# EAGLE design Mem128_rev_A (EAGLE 9.6.2)
PC Engine Joypad Breakout Version 1.0
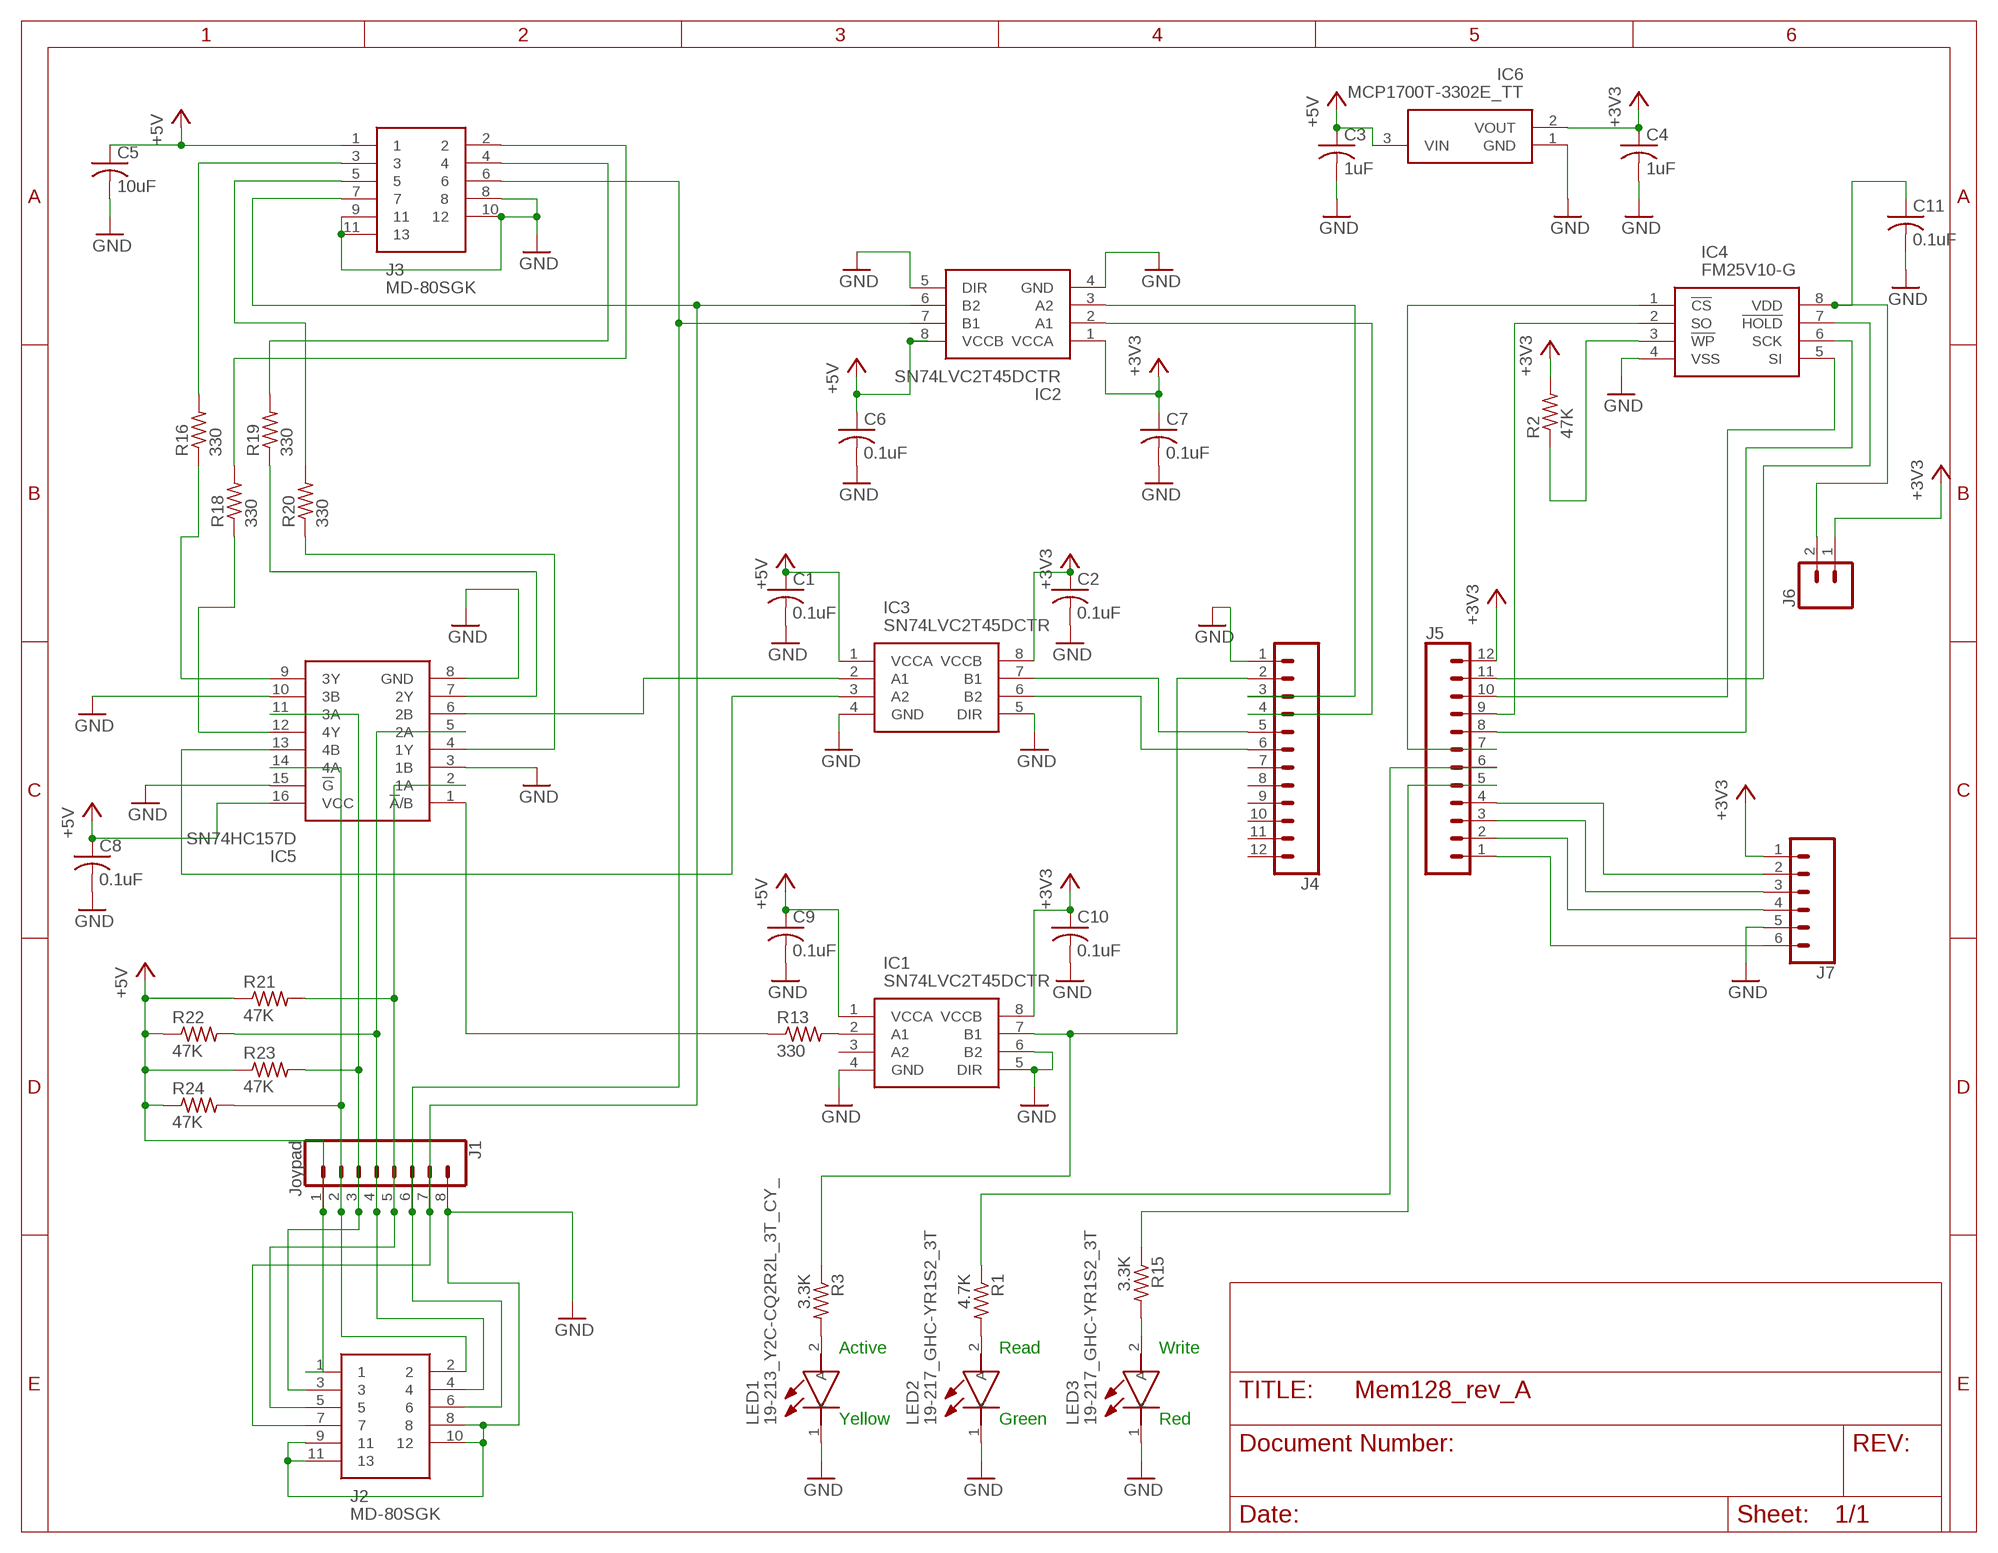
[diagram p0: schematic, sheet 1]

## Parts
C1  0.1uF  C-USC0603  [C0603]
C2  0.1uF  C-USC0603  [C0603]
C3  1uF  C-USC0603  [C0603]
C4  1uF  C-USC0603  [C0603]
C5  10uF  C-USC0805  [C0805]
C6  0.1uF  C-USC0603  [C0603]
C7  0.1uF  C-USC0603  [C0603]
C8  0.1uF  C-USC0603  [C0603]
C9  0.1uF  C-USC0603  [C0603]
C10  0.1uF  C-USC0603  [C0603]
C11  0.1uF  C-USC0603  [C0603]
IC1  SN74LVC2T45DCTR  [SOP65P400X130-8N]
IC2  SN74LVC2T45DCTR  [SOP65P400X130-8N]
IC3  SN74LVC2T45DCTR  [SOP65P400X130-8N]
IC4  FM25V10-G  [SOIC127P602X173-8N]
IC5  SN74HC157D  [SOIC127P600X175-16N]
IC6  MCP1700T-3302E_TT  [SOT95P237X112-3N]
J1  Joypad  CONN_08"  [1X08]
J2  MD-80SGK  [MD80SGK]
J3  MD-80SGK  [MD80SGK]
J4  CONN_12  [1X12]
J5  CONN_12  [1X12]
J6  CONN_02  [1X02]
J7  CONN_06NO_SILK_FEMALE_PTH  [1X06_NO_SILK]
LED1  19-213_Y2C-CQ2R2L_3T_CY_  [LEDC1608X60N]
LED2  19-217_GHC-YR1S2_3T  [LEDC1608X50N]
LED3  19-217_GHC-YR1S2_3T  [LEDC1608X50N]
R1  4.7K  R-US_R0603  [R0603]
R2  47K  R-US_R0603  [R0603]
R3  3.3K  R-US_R0603  [R0603]
R13  330  R-US_R0603  [R0603]
R15  3.3K  R-US_R0603  [R0603]
R16  330  R-US_R0603  [R0603]
R18  330  R-US_R0603  [R0603]
R19  330  R-US_R0603  [R0603]
R20  330  R-US_R0603  [R0603]
R21  47K  R-US_R0603  [R0603]
R22  47K  R-US_R0603  [R0603]
R23  47K  R-US_R0603  [R0603]
R24  47K  R-US_R0603  [R0603]

## Nets
+3V3 [power]: C2.1 C4.1 C7.1 C10.1 IC1.8(VCCB) IC2.1(VCCA) IC3.8(VCCB) IC6.2(VOUT) J5.12 J6.1 J7.1 R2.2
+5V [power]: C1.1 C3.1 C5.1 C6.1 C8.1 C9.1 IC1.1(VCCA) IC2.8(VCCB) IC3.1(VCCA) IC5.16(VCC) IC6.3(VIN) J1.1 J2.1 J3.1 R21.1 R22.1 R23.1 R24.1
CLR [signal]: IC2.6(B2) J1.7 J2.7 J3.7
D6 [signal]: J5.5 R15.1
D10 [signal]: J5.6 R1.1
D11 [signal]: IC1.7(B1) J4.2 R3.1
GND: C1.2 C2.2 C3.2 C4.2 C5.2 C6.2 C7.2 C8.2 C9.2 C10.2 C11.2 IC1.4(GND) IC1.5(DIR) IC1.6(B2) IC2.4(GND) IC2.5(DIR) IC3.4(GND) IC3.5(DIR) IC4.4(VSS) IC5.3(1B) IC5.8(GND) IC5.10(3B) IC5.15(!G) IC6.1(GND) J1.8 J2.8 J2.9 J2.10 J2.11 J3.8 J3.9 J3.10 J3.11 J4.1 J7.5 LED1.1(K) LED2.1(K) LED3.1(K)
N$1: LED2.2(A) R1.2
N$2 [signal]: IC5.11(3A) J1.3 J2.3 R23.2
N$3 [signal]: IC5.14(4A) J1.2 J2.2 R24.2
N$5: LED1.2(A) R3.2
N$6: IC4.7(!HOLD) J5.11
N$7: IC4.6(SCK) J5.8
N$8: J3.5 R20.2
N$10: J3.4 R19.2
N$11: J3.3 R16.2
N$12 [power]: C11.1 IC4.8(VDD) J6.2
N$14: IC5.1(!A!/B) R13.1
N$15: IC1.2(A1) R13.2
N$16: IC5.5(2A) J1.4 J2.4 R22.2
N$17: IC5.9(3Y) R16.1
N$18: IC5.2(1A) J1.5 J2.5 R21.2
N$19: IC3.2(A1) IC5.6(2B)
N$20: IC5.12(4Y) R18.1
N$22: IC5.4(1Y) R20.1
N$23: J3.2 R18.2
N$24: IC5.7(2Y) R19.1
N$25: IC4.3(!WP) R2.1
N$26: IC4.1(!CS) J5.7
N$28: IC4.5(SI) J5.10
N$30: IC3.3(A2) IC5.13(4B)
N$31: IC4.2(SO) J5.9
N$32: IC2.3(A2) J4.3
N$33: IC3.7(B1) J4.5
N$34: IC3.6(B2) J4.6
N$35: J5.1 J7.6
N$36: LED3.2(A) R15.2
N$37: J5.2 J7.4
N$38: J5.3 J7.3
N$39: J5.4 J7.2
RX: IC2.2(A1) J4.4
SEL [signal]: IC2.7(B1) J1.6 J2.6 J3.6
Unconnected: IC1.3(A2) J4.7 J4.8 J4.9 J4.10 J4.11 J4.12

## Notes on the sheet
- Active | Read | Write
- Yellow | Green | Red

## Library data of the parts
C1-C11 = resistor:C-US: CAPACITOR, American symbol
IC1-IC3 = SamacSys_Parts:SN74LVC2T45DCTR: 2-Bit Bus Transceiver, Translation SSOP8 SN74LVC2T45DCTR, Voltage Level Translator, Bus Transceiver LVC, 3-State 1.65 Source: Datasheet <http://www.ti.com/lit/ds/symlink/sn74lvc2t45.pdf>; DESCRIPTION: 2-Bit Bus Transceiver, Translation SSOP8 SN74LVC2T45DCTR, Voltage Level Translator, Bus Transceiver LVC, 3-State 1.65; HEIGHT: 1.3mm; MANUFACTURER_NAME: Texas Instruments; MANUFACTURER_PART_NUMBER: SN74LVC2T45DCTR; MOUSER_PART_NUMBER: 595-SN74LVC2T45DCTR; MOUSER_PRICE-STOCK: https://www.mouser.com/Search/Refine.aspx?Keyword=595-SN74LVC2T45DCTR; RS_PART_NUMBER: 9213022; RS_PRICE-STOCK: http://uk.rs-online.com/web/p/products/9213022
IC4 = PC-Engine:FM25V10-G: F-RAM,128KB,SPI,40MHz,3V,SOIC8 FM25V10-G Serial-SPI FRAM Memory, 1Mbit, 2 3.6 V 8-Pin SOIC Source: Datasheet <http://www.cypress.com/file/41691/download>; ARROW_PART_NUMBER: FM25V10-G; ARROW_PRICE-STOCK: https://www.arrow.com/en/products/fm25v10-g/cypress-semiconductor; DESCRIPTION: F-RAM,128KB,SPI,40MHz,3V,SOIC8 FM25V10-G Serial-SPI FRAM Memory, 1Mbit, 2 3.6 V 8-Pin SOIC; HEIGHT: 1.727mm; MANUFACTURER_NAME: Cypress Semiconductor; MANUFACTURER_PART_NUMBER: FM25V10-G; MOUSER_PART_NUMBER: 877-FM25V10-G; MOUSER_PRICE-STOCK: https://www.mouser.co.uk/ProductDetail/Cypress-Semiconductor/FM25V10-G?qs=pA5MXup5wxFqKGjf8NeQmw%3D%3D
IC5 = PC-Engine:SN74HC157D: Quadruple 2-Line To 1-Line Data Selectors/Multiplexers Source: Datasheet <http://www.ti.com/lit/ds/symlink/sn74hc157.pdf>; ARROW_PART_NUMBER: SN74HC157D; ARROW_PRICE-STOCK: https://www.arrow.com/en/products/sn74hc157d/texas-instruments; DESCRIPTION: Quadruple 2-Line To 1-Line Data Selectors/Multiplexers; HEIGHT: 1.75mm; MANUFACTURER_NAME: Texas Instruments; MANUFACTURER_PART_NUMBER: SN74HC157D; MOUSER_PART_NUMBER: 595-SN74HC157D; MOUSER_PRICE-STOCK: https://www.mouser.co.uk/ProductDetail/Texas-Instruments/SN74HC157D?qs=UGVLDq%2F29uhSeVegTExyng%3D%3D
IC6 = PC-Engine:MCP1700T-3302E_TT: LDO voltage regulator 250mA Isupply 1uA Source: Datasheet <http://docs-emea.rs-online.com/webdocs/0dd1/0900766b80dd189b.pdf>; ARROW_PART_NUMBER: MCP1700T-3302E/TT; ARROW_PRICE-STOCK: https://www.arrow.com/en/products/mcp1700t-3302ett/microchip-technology; DESCRIPTION: LDO voltage regulator 250mA Isupply 1uA; HEIGHT: 1.12mm; MANUFACTURER_NAME: Microchip; MANUFACTURER_PART_NUMBER: MCP1700T-3302E/TT; MOUSER_PART_NUMBER: 579-MCP1700T3302E/TT; MOUSER_PRICE-STOCK: https://www.mouser.co.uk/ProductDetail/Microchip-Technology/MCP1700T-3302E-TT?qs=fM4xO01eazPmCNDrdHEdaw%3D%3D
J1 = SparkFun-Connectors:CONN_08: Multi connection point. Often used as Generic Header-pin footprint for 0.1 inch spaced/style header connections On any of the 0.1 inch spaced packages, you can populate with these: Break Away Headers - Straight <https://www.sparkfun.com/products/116> (PRT-00116) Break Away Male Headers - Right Angle <https://www.sparkfun.com/products/553> (PRT-00553) Female Headers <https://www.sparkfun.com/products/115> (PRT-00115) Break Away Headers - Machine Pin <https://www.sparkfun.com/products/117> (PRT-00117) Break Away Female Headers - Swiss Machine Pin <https://www.sparkfun.com/products/743> (PRT-00743) Arduino Stackable Header - 8 Pin <https://www.sparkfun.com/products/9279> (PRT-09279) For SCREWTERMINALS and SPRING TERMINALS visit here: Screw Terimnals on SparkFun.com <https://www.sparkfun.com/search/results?term=Screw+Terminals> (5mm/3.5mm/2.54mm spacing) This device is also useful as a general connection point to wire up your design to another part of your project. Our various solder wires solder well into these plated through hole pads. Hook-Up Wire - Assortment (Stranded, 22 AWG) <https://www.sparkfun.com/products/11375> (PRT-11375) Hook-Up Wire - Assortment (Solid Core, 22 AWG) <https://www.sparkfun.com/products/11367> (PRT-11367) View the entire wire category on our website here <https://www.sparkfun.com/categories/141> Special notes: Molex polarized connector foot print use with SKU : PRT-08231 with associated crimp pins and housings. 1MM SMD Version SKU: PRT-10208 NOTES ON THE VARIANTS LOCK and LOCK_LONGPADS... This footprint was designed to help hold the alignment of a through-hole component (i.e. 6-pin header) while soldering it into place. You may notice that each hole has been shifted either up or down by 0.005 of an inch from it's more standard position (which is a perfectly straight line). This slight alteration caused the pins (the squares in the middle) to touch the edges of the holes. Because they are alternating, it causes a "brace" to hold the component in place. 0.005 has proven to be the perfect amount of "off-center" position when using our standard breakaway headers. Although looks a little odd when you look at the bare footprint, once you have a header in there, the alteration is very hard to notice. Also,if you push a header all the way into place, it is covered up entirely on the bottom side.; PROD_ID: CONN-08438
J2 J3 = SamacSys_Parts:MD-80SGK: Circular DIN Connectors mini-DIN, 8P jack, rt, through hole, full shield Source: Datasheet <https://www.cui.com/product/resource/md-sgk-series.pdf>; DESCRIPTION: Circular DIN Connectors mini-DIN, 8P jack, rt, through hole, full shield; HEIGHT: 13mm; MANUFACTURER_NAME: CUI; MANUFACTURER_PART_NUMBER: MD-80SGK; MOUSER_PART_NUMBER: 490-MD-80SGK; MOUSER_PRICE-STOCK: https://www.mouser.com/Search/Refine.aspx?Keyword=490-MD-80SGK
J4 J5 = SparkFun-Connectors:CONN_12: Multi connection point. Often used as Generic Header-pin footprint for 0.1 inch spaced/style header connections On any of the 0.1 inch spaced packages, you can populate with these: Break Away Headers - Straight <https://www.sparkfun.com/products/116> (PRT-00116) Break Away Male Headers - Right Angle <https://www.sparkfun.com/products/553> (PRT-00553) Female Headers <https://www.sparkfun.com/products/115> (PRT-00115) Break Away Headers - Machine Pin <https://www.sparkfun.com/products/117> (PRT-00117) Break Away Female Headers - Swiss Machine Pin <https://www.sparkfun.com/products/743> (PRT-00743) For SCREWTERMINALS and SPRING TERMINALS visit here: Screw Terimnals on SparkFun.com <https://www.sparkfun.com/search/results?term=Screw+Terminals> (5mm/3.5mm/2.54mm spacing) This device is also useful as a general connection point to wire up your design to another part of your project. Our various solder wires solder well into these plated through hole pads. Hook-Up Wire - Assortment (Stranded, 22 AWG) <https://www.sparkfun.com/products/11375> (PRT-11375) Hook-Up Wire - Assortment (Solid Core, 22 AWG) <https://www.sparkfun.com/products/11367> (PRT-11367) View the entire wire category on our website here <https://www.sparkfun.com/categories/141> Special notes: Molex polarized connector foot print use with SKU : PRT-08231 with associated crimp pins and housings. 1MM SMD Version SKU: PRT-10208 NOTES ON THE VARIANTS LOCK and LOCK_LONGPADS... This footprint was designed to help hold the alignment of a through-hole component (i.e. 6-pin header) while soldering it into place. You may notice that each hole has been shifted either up or down by 0.005 of an inch from it's more standard position (which is a perfectly straight line). This slight alteration caused the pins (the squares in the middle) to touch the edges of the holes. Because they are alternating, it causes a "brace" to hold the component in place. 0.005 has proven to be the perfect amount of "off-center" position when using our standard breakaway headers. Although looks a little odd when you look at the bare footprint, once you have a header in there, the alteration is very hard to notice. Also,if you push a header all the way into place, it is covered up entirely on the bottom side.
J6 = SparkFun-Connectors:CONN_02: Multi connection point. Often used as Generic Header-pin footprint for 0.1 inch spaced/style header connections On any of the 0.1 inch spaced packages, you can populate with these: Break Away Headers - Straight <https://www.sparkfun.com/products/116> (PRT-00116) Break Away Male Headers - Right Angle <https://www.sparkfun.com/products/553> (PRT-00553) Female Headers <https://www.sparkfun.com/products/115> (PRT-00115) Break Away Headers - Machine Pin <https://www.sparkfun.com/products/117> (PRT-00117) Break Away Female Headers - Swiss Machine Pin <https://www.sparkfun.com/products/743> (PRT-00743) For SCREWTERMINALS and SPRING TERMINALS visit here: Screw Terimnals on SparkFun.com <https://www.sparkfun.com/search/results?term=Screw+Terminals> (5mm/3.5mm/2.54mm spacing) This device is also useful as a general connection point to wire up your design to another part of your project. Our various solder wires solder well into these plated through hole pads. Hook-Up Wire - Assortment (Stranded, 22 AWG) <https://www.sparkfun.com/products/11375> (PRT-11375) Hook-Up Wire - Assortment (Solid Core, 22 AWG) <https://www.sparkfun.com/products/11367> (PRT-11367) View the entire wire category on our website here <https://www.sparkfun.com/categories/141> Special notes: Molex polarized connector foot print use with: PRT-08233 with associated crimp pins and housings. 2.54_SCREWTERM for use with PRT-10571. 3.5mm Screw Terminal footprints for PRT-08084 5mm Screw Terminal footprints for use with PRT-08432
J7 = SparkFun-Connectors:CONN_06: Multi connection point. Often used as Generic Header-pin footprint for 0.1 inch spaced/style header connections On any of the 0.1 inch spaced packages, you can populate with these: Break Away Headers - Straight <https://www.sparkfun.com/products/116> (PRT-00116) Break Away Male Headers - Right Angle <https://www.sparkfun.com/products/553> (PRT-00553) Female Headers <https://www.sparkfun.com/products/115> (PRT-00115) Break Away Headers - Machine Pin <https://www.sparkfun.com/products/117> (PRT-00117) Break Away Female Headers - Swiss Machine Pin <https://www.sparkfun.com/products/743> (PRT-00743) Arduino Stackable Header - 6 Pin <https://www.sparkfun.com/products/9280> (PRT-09280) For SCREWTERMINALS and SPRING TERMINALS visit here: Screw Terimnals on SparkFun.com <https://www.sparkfun.com/search/results?term=Screw+Terminals> (5mm/3.5mm/2.54mm spacing) This device is also useful as a general connection point to wire up your design to another part of your project. Our various solder wires solder well into these plated through hole pads. Hook-Up Wire - Assortment (Stranded, 22 AWG) <https://www.sparkfun.com/products/11375> (PRT-11375) Hook-Up Wire - Assortment (Solid Core, 22 AWG) <https://www.sparkfun.com/products/11367> (PRT-11367) View the entire wire category on our website here <https://www.sparkfun.com/categories/141>; PROD_ID: CONN-08437
LED1 = PC-Engine:19-213_Y2C-CQ2R2L_3T_CY_: 0603 Package Chip LED (0.6mm Height) Source: Datasheet <https://datasheet.lcsc.com/szlcsc/Everlight-Elec-19-213-Y2C-CQ2R2L-3T-CY_C72038.pdf>; ARROW_PART_NUMBER: 19-213/Y2C-CQ2R2L/3T(CY); DESCRIPTION: 0603 Package Chip LED (0.6mm Height); HEIGHT: 0.6mm; MANUFACTURER_NAME: Everlight Elec; MANUFACTURER_PART_NUMBER: 19-213/Y2C-CQ2R2L/3T(CY)
LED2 = PC-Engine:19-217_GHC-YR1S2_3T: Standard LEDs - SMD Source: Datasheet <https://www.arrow.com/en/products/19-217ghc-yr1s23t/everlight-electronics>; ARROW_PART_NUMBER: 19-217/GHC-YR1S2/3T; ARROW_PRICE-STOCK: https://www.arrow.com/en/products/19-217ghc-yr1s23t/everlight-electronics; DESCRIPTION: Standard LEDs - SMD; HEIGHT: 0.5mm; MANUFACTURER_NAME: Everlight; MANUFACTURER_PART_NUMBER: 19-217/GHC-YR1S2/3T; MOUSER_PART_NUMBER: 638-19217GHCYR1S23T; MOUSER_PRICE-STOCK: https://www.mouser.co.uk/ProductDetail/Everlight/19-217-GHC-YR1S2-3T?qs=8cKuZ6Ok2lZjmFTUzVFjDg%3D%3D
LED3 = PC-Engine:19-217_GHC-YR1S2_3T: Standard LEDs - SMD Source: Datasheet <https://www.arrow.com/en/products/19-217ghc-yr1s23t/everlight-electronics>; ARROW_PART_NUMBER: 19-217/GHC-YR1S2/3T; ARROW_PRICE-STOCK: https://www.arrow.com/en/products/19-217ghc-yr1s23t/everlight-electronics; DESCRIPTION: Standard LEDs - SMD; HEIGHT: 0.5mm; MANUFACTURER_NAME: Hubei Kento; MANUFACTURER_PART_NUMBER: KT-0603R; MOUSER_PART_NUMBER: 638-19217GHCYR1S23T; MOUSER_PRICE-STOCK: https://www.mouser.co.uk/ProductDetail/Everlight/19-217-GHC-YR1S2-3T?qs=8cKuZ6Ok2lZjmFTUzVFjDg%3D%3D
R1-R3 R13 R15 R16 R18-R24 = resistor:R-US_: RESISTOR, American symbol

## Net classes
0 default: width 0.152 mm, drill 0.356 mm, clearance 0.152 mm
1 power: width 0.305 mm, drill 0.356 mm, clearance 0.152 mm
2 signal: width 0.152 mm, drill 0.356 mm, clearance 0.152 mm

## Board
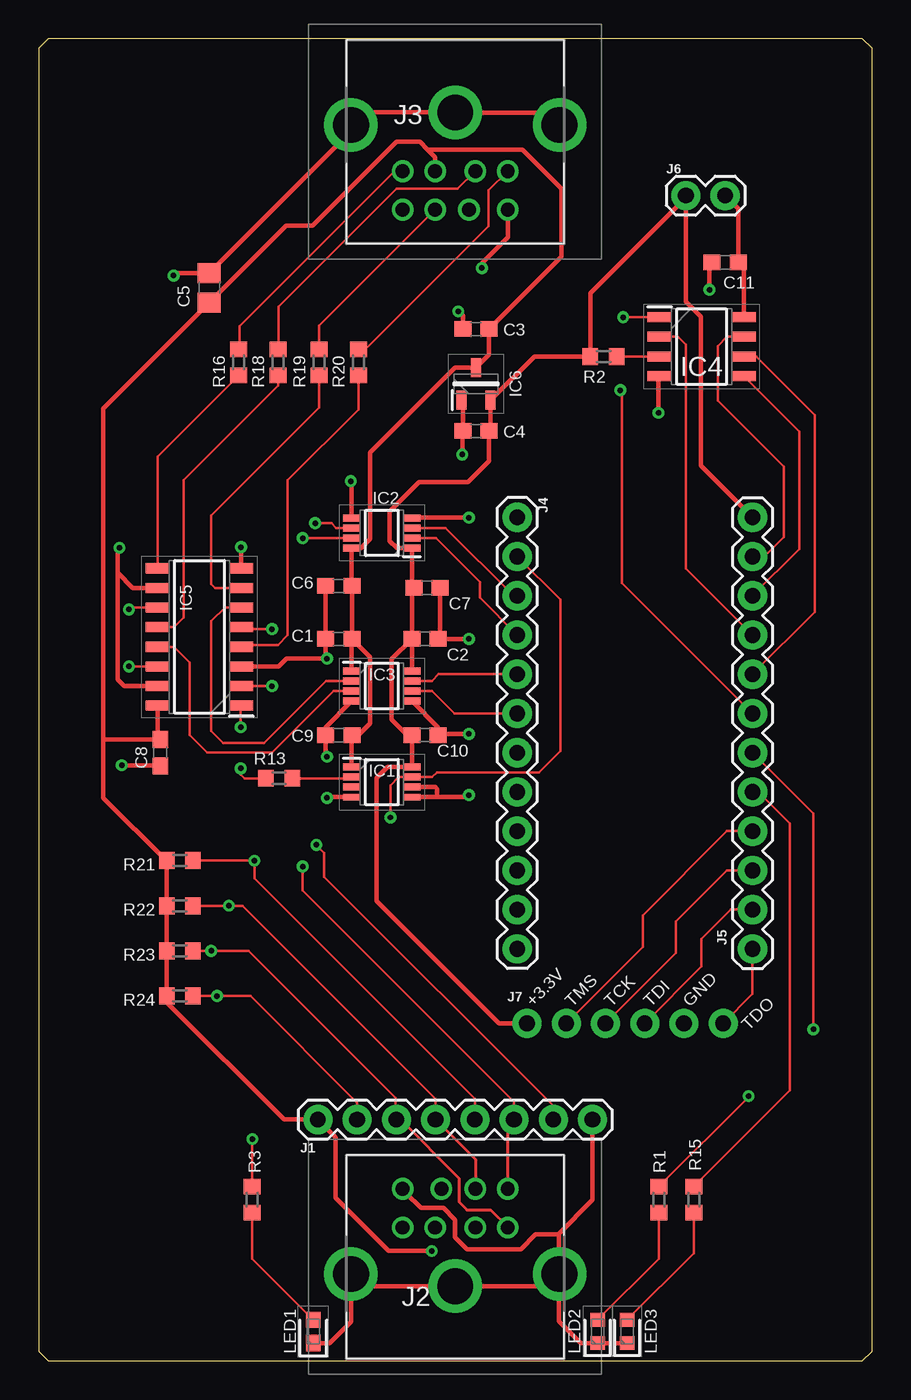
[diagram p1: board, top side]
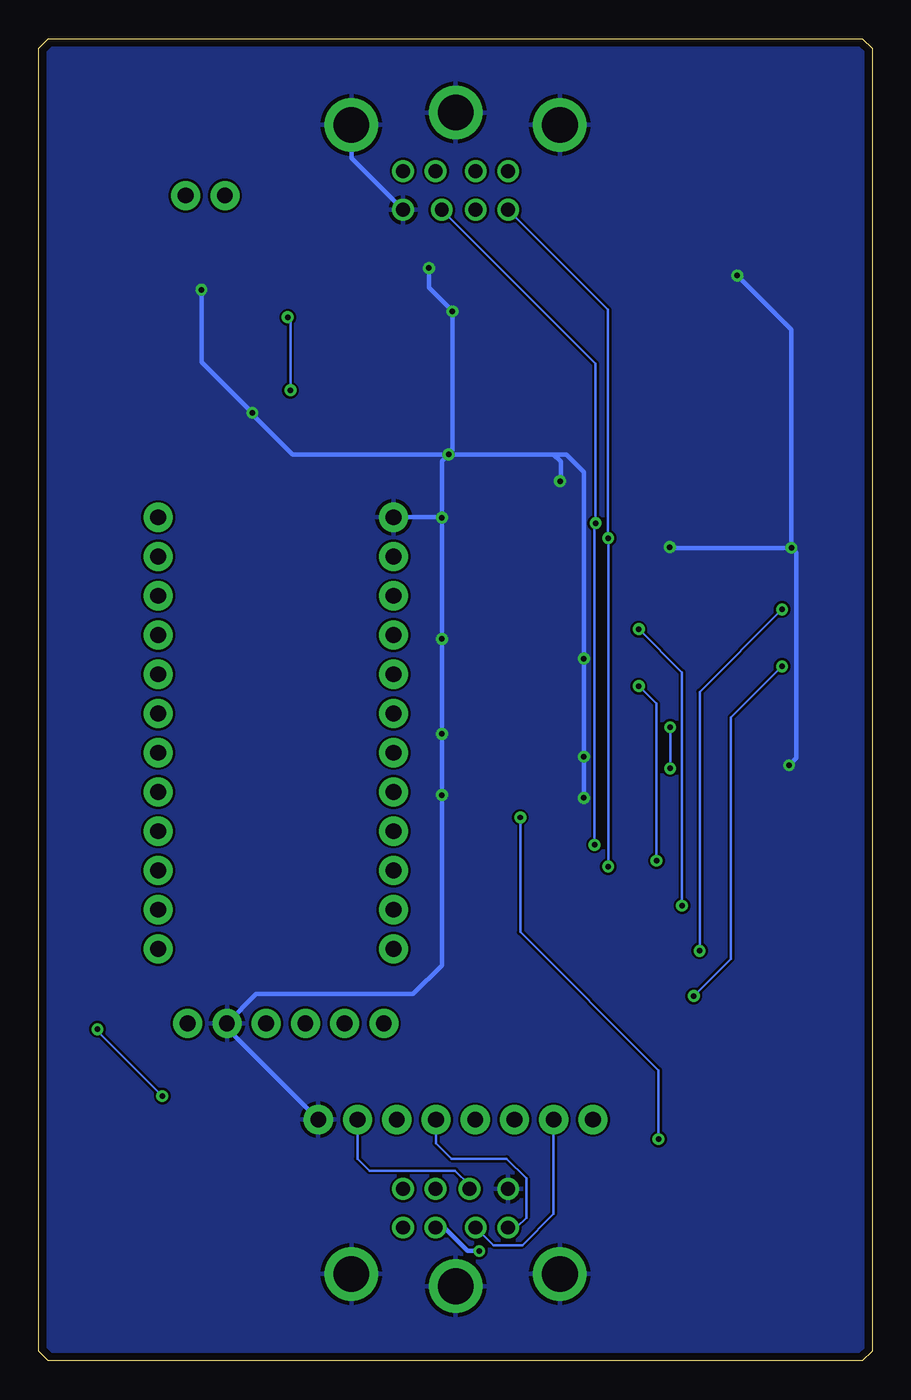
[diagram p2: board, bottom side, seen from below]

Size 53.98 x 85.6 mm. Coordinates in mm from the lower left corner, seen from the top.
Outline: 53.34,85.6 0.64,85.6 0,84.96 0,0.64 0.64,0 53.34,0 53.98,0.64 53.98,84.96 53.34,85.6
Copper layers (1*16): Top 0.035mm / dielectric 1.5mm / Bottom 0.035mm
Design rules "default *": minimum track width 6mil, minimum drill 0.35mm, track to track 6mil, track to pad 6mil, pad to pad 6mil, via to via 6mil, smd to smd 6mil, copper to edge 20mil, drill to drill 6mil, minimum pad ring 10mil, minimum via ring 8mil, stop-mask expansion 3mil, vias tented up to drill 0mil, thermal gap 10mil

### Footprints (pad centres in the part's own frame; a part is rotated, then mirrored left to right if it is on the bottom)
C0603 = smd 1.1 x 1: 1 -0.85,0; 2 0.85,0
C0805 = smd 1.3 x 1.5: 1 -0.95,0; 2 0.95,0
SOP65P400X130-8N = smd 1.1 x 0.45: 1 -1.95,0.975; 2 -1.95,0.325; 3 -1.95,-0.325; 4 -1.95,-0.975; 5 1.95,-0.975; 6 1.95,-0.325; 7 1.95,0.325; 8 1.95,0.975
SOIC127P602X173-8N = smd 1.551 x 0.65: 1 -2.725,1.905; 2 -2.725,0.635; 3 -2.725,-0.635; 4 -2.725,-1.905; 5 2.725,-1.905; 6 2.725,-0.635; 7 2.725,0.635; 8 2.725,1.905
SOIC127P600X175-16N = smd 1.525 x 0.65: 1 -2.712,4.445; 2 -2.712,3.175; 3 -2.712,1.905; 4 -2.712,0.635; 5 -2.712,-0.635; 6 -2.712,-1.905; 7 -2.712,-3.175; 8 -2.712,-4.445; 9 2.712,-4.445; 10 2.712,-3.175; 11 2.712,-1.905; 12 2.712,-0.635; 13 2.712,0.635; 14 2.712,1.905; 15 2.712,3.175; 16 2.712,4.445
SOT95P237X112-3N = smd 1.25 x 0.65: 1 -1.05,0.95; 2 -1.05,-0.95; 3 1.05,0
1X08 = drill 1.016 pad 1.88: 1 0,0; 2 2.54,0; 3 5.08,0; 4 7.62,0; 5 10.16,0; 6 12.7,0; 7 15.24,0; 8 17.78,0
MD80SGK = drill 0.9 pad 1.4: 1 -1.3,-1.9; 2 1.3,-1.9; 3 -3.4,-1.9; 4 -1.3,-4.4; 5 3.4,-1.9; 6 -3.4,-4.4; 7 0.9,-4.4; 8 3.4,-4.4 | drill 2.309 pad 3.463: 9 0,1.9; 10 -6.75,1.1; 11 6.75,1.1
1X12 = drill 1.016 pad 1.88: 1 0,0; 2 2.54,0; 3 5.08,0; 4 7.62,0; 5 10.16,0; 6 12.7,0; 7 15.24,0; 8 17.78,0; 9 20.32,0; 10 22.86,0; 11 25.4,0; 12 27.94,0
1X02 = drill 1.016 pad 1.88: 1 0,0; 2 2.54,0
1X06_NO_SILK = drill 1.016 pad 1.88: 1 0,0; 2 2.54,0; 3 5.08,0; 4 7.62,0; 5 10.16,0; 6 12.7,0
LEDC1608X60N = smd 1.05 x 0.95: 1 -0.75,0; 2 0.75,0
LEDC1608X50N = smd 0.9 x 0.95: 1 -0.75,0; 2 0.75,0
R0603 = smd 1 x 1.1: 1 -0.85,0; 2 0.85,0

### Placement (x,y rotation side)
C1  19.43,46.74 180 top
C2  25.02,46.74 0 top
C3  28.32,66.8 180 top
C4  28.32,60.2 180 top
C5  11.05,69.47 90 top
C6  19.43,50.16 180 top
C7  25.15,50.04 0 top
C8  7.87,39.37 270 top
C9  19.43,40.51 180 top
C10  25.02,40.51 0 top
C11  44.45,71.12 180 top
IC1  22.23,37.47 0 top
IC2  22.23,53.59 180 top
IC3  22.23,43.69 0 top
IC4  42.93,65.66 0 top
IC5  10.41,46.86 180 top
IC6  28.32,63.25 90 top
J1  18.08,15.62 0 top
J2  26.97,6.73 180 top
J3  26.97,78.92 0 top
J4  30.99,54.61 270 top
J5  46.23,26.67 90 top
J6  41.91,75.44 0 top
J7  31.62,21.84 0 top
LED1  17.78,1.91 90 top
LED2  36.2,1.91 90 top
LED3  38.1,1.91 90 top
R1  40.16,10.44 270 top
R2  36.58,65.02 180 top
R3  13.82,10.44 270 top
R13  15.57,37.72 0 top
R15  42.42,10.44 270 top
R16  12.95,64.64 90 top
R18  15.49,64.64 90 top
R19  18.16,64.64 90 top
R20  20.7,64.64 90 top
R21  9.14,32.38 0 top
R22  9.14,29.46 0 top
R23  9.14,26.54 0 top
R24  9.14,23.62 0 top

### Tracks (layer width: path | path; a pad name or v marks a point on that pad's centre or on a via)
+3V3
  Top 0.305: C10.1 24.18,40.53 | 24.18,40.53 IC1.8 22.59,38.44 21.89,37.74 21.89,29.77 29.82,21.84 J7.1 | C2.1 24.17,49.91 C7.1 24.18,50.16 IC2.1 23.2,52.62 22.73,53.09 22.73,54.99 24.64,56.9 27.81,56.9 29.17,58.25 C4.1 29.27,60.3 IC6.2 32.1,65.02 R2.2 35.73,69.13 41.91,75.31 J6.1 41.91,68.58 42.88,67.61 42.88,57.96 J5.12 | IC3.8 C2.1 | C2.1 22.86,45.43 22.86,41.53 23.86,40.53 24.18,40.53
+5V  (via drill 0.36)
  Top 0.305: IC1.1 20.27,40.53 | 20.27,40.53 C9.1 | v25.45,7.11 22.66,7.11 19.23,10.54 19.23,14.48 J1.1 15.89,15.62 8.29,23.21 R24.1 R23.1 R22.1 R21.1 8.26,32.38 4.19,36.45 4.19,40.18 | 25.2,78.41 25.68,77.93 J3.1 | 25.2,78.41 24.69,78.92 23.16,78.92 17.74,73.5 16.03,73.5 C5.1 4.19,61.66 4.19,40.18 | 25.2,78.41 31.34,78.41 33.86,75.89 33.86,71.49 C3.1 29.17,65.15 IC6.3 26.96,64.3 21.46,58.8 21.46,53.21 20.87,52.62 IC2.8 C6.1 C1.1 | C1.1 21.46,45.55 21.46,41.27 20.72,40.53 20.27,40.53 | IC3.1 C1.1 | IC5.16 7.7,40.39 C8.1 4.23,40.22 4.19,40.18
  Bottom 0.305: v25.45,7.11 26.22,7.11 27.74,8.63 J2.1
CLR  (via drill 0.36)
  Top 0.152: IC2.6 19.27,53.92 18.96,54.23 v17.91,54.23 | J1.7 33.33,16.51 18.49,31.34 18.49,32.89 v17.98,33.4
  Bottom 0.152: J2.7 26.07,11.38 27.01,12.32 32.56,12.32 33.33,13.08 J1.7 | J3.7 17.91,64.55 v17.91,54.23 17.98,54.15 v17.98,33.4
D6
  Top 0.152: R15.1 48.64,17.51 48.64,34.8 46.61,36.83 J5.5
D10  (via drill 0.36)
  Top 0.152: v45.97,17.14 45.97,17.11 R1.1 | J5.6 50.16,35.43 v50.16,21.46
  Bottom 0.152: v45.97,17.14 50.16,21.34 v50.16,21.46
D11  (via drill 0.36)
  Top 0.152: R3.1 13.82,14.33 v13.84,14.35 | v22.78,35.18 22.78,37.26 23.31,37.79 IC1.7 25.47,37.79 25.78,38.1 32.38,38.1 33.78,39.5 33.78,49.28 J4.2
  Bottom 0.152: v22.78,35.18 22.78,27.76 13.84,18.82 v13.84,14.35
GND  (via drill 0.36)
  Top 0.305: 33.64,8.19 33.71,8.19 33.71,5.65 | 33.64,8.19 32.18,8.19 31.23,7.24 27.74,7.24 26.98,8 26.98,9.14 26.21,9.91 24.75,9.91 23.8,10.86 J2.8 | 33.71,5.65 J2.10 32.92,4.83 J2.9 21.02,4.83 J2.11 20.23,2.55 18.83,1.16 LED1.1 | J1.8 35.87,10.41 33.64,8.19 | J3.11 32.92,80.82 J3.9 21.03,80.82 J3.10 20.23,79.59 C5.2 8.9,70.42 v8.74,70.26 | J3.8 30.38,72.75 28.7,71.07 v28.7,70.74 | C6.2 C1.2 18.58,45.55 v18.67,45.47 16.05,45.47 15.54,44.96 IC5.3 | C7.2 26,46.86 C2.2 v27.86,46.74 | IC3.4 18.58,41.02 C9.2 18.58,39.2 v18.67,39.12 | IC2.4 24.19,54.59 v27.86,54.59 | IC6.1 27.47,62.1 C4.2 27.43,60.16 v27.43,58.67 | C3.2 27.47,67.65 v27.18,67.94 | v18.67,36.45 18.71,36.49 IC1.4 | IC3.5 25.87,41.02 C10.2 25.95,40.59 v27.86,40.59 | IC1.5 25.81,36.49 | 25.81,36.49 27.73,36.49 v27.86,36.63 | IC1.6 25.7,37.14 25.81,37.03 25.81,36.49 | v13.11,52.68 13.13,52.66 IC5.8 | IC5.10 6.1,50.04 5.11,51.03 | v5.38,38.56 7.84,38.56 C8.2 | 5.11,51.03 5.11,44.12 5.54,43.69 IC5.15 | 5.11,51.03 5.11,52.5 v5.23,52.63 | v40.13,61.37 40.13,63.69 IC4.4 | 33.71,5.65 33.71,2.56 35.12,1.16 LED2.1 LED3.1 | IC2.5 20.27,56.89 v20.22,56.95 | v43.43,69.34 43.43,70.95 C11.2
  Bottom 0.305: J3.8 33.73,77.87 J3.11 | v28.7,70.74 28.7,69.47 v27.18,67.94 27.18,58.93 v27.43,58.67 | v27.86,54.59 27.89,54.61 J4.1 | v27.43,58.67 27.86,58.24 v27.86,54.59 | v27.43,58.67 20.62,58.67 | 20.62,58.67 19.81,58.67 18.67,57.53 v18.67,45.47 v18.67,39.12 v18.67,36.45 | J1.8 41.78,21.54 J7.5 39.88,23.75 29.72,23.75 27.86,25.6 v27.86,36.63 v27.86,40.59 v27.86,46.74 v27.86,54.59 | v8.74,70.26 5.23,66.75 v5.23,52.63 | v5.23,52.63 13.06,52.63 v13.11,52.68 | v5.38,38.56 4.93,39.01 4.93,52.32 v5.23,52.63 | v27.43,58.67 37.54,58.67 40.13,61.27 v40.13,61.37 43.43,64.67 v43.43,69.34 | v20.22,56.95 20.17,57 20.17,58.22 20.62,58.67
  pour Bottom: -0.51,-0.51 -0.51,86.36 54.61,86.36 54.61,-0.51
N$1
  Top 0.152: LED2.2 40.16,6.62 R1.2
N$2  (via drill 0.36)
  Top 0.152: R23.2 v11.18,26.54 13.59,26.54 23.11,17.02 23.11,15.67 J1.3 | v5.84,48.64 5.97,48.77 IC5.11
  Top 0.203: J1.3 23.42,15.62 27.23,11.81 27.23,10.29 27.74,9.78 29.26,9.78 30.38,8.66 J2.3
  Bottom 0.152: v11.18,26.54 11.18,43.31 v5.84,48.64
N$3  (via drill 0.36)
  Top 0.152: R24.2 v11.56,23.62 13.72,23.62 20.62,16.71 J1.2 | v5.84,44.96 IC5.14
  Bottom 0.152: J2.2 24.54,7.49 22.66,7.49 20.62,9.53 J1.2 | v11.56,23.62 9.14,26.04 9.14,41.66 v5.84,44.96
N$5
  Top 0.152: LED1.2 13.82,6.62 R3.2
N$6
  Top 0.152: IC4.7 44.58,66.29 43.97,65.68 43.97,62.18 48.26,57.89 48.26,53.34 46.99,52.07 J5.11
N$7
  Top 0.152: J5.8 50.27,48.49 50.27,61.24 46.48,65.02 IC4.6
N$8
  Top 0.152: J3.5 29.13,75.78 29.13,73.46 21.17,65.49 R20.2
N$10
  Top 0.152: J3.4 18.16,67 R19.2
N$11
  Top 0.152: J3.3 23.04,77.02 13.01,66.98 13.01,65.54 R16.2
N$12
  Top 0.305: IC4.8 45.65,70.77 C11.1 45.3,74.59 J6.2
N$14  (via drill 0.36)
  Top 0.152: R13.1 13.34,37.72 13.08,37.97 v13.08,38.35 | v13.08,41.02 13.08,42.37 IC5.1
  Bottom 0.152: v13.08,38.35 v13.08,41.02
N$15
  Top 0.152: IC1.2 20.2,37.72 R13.2
N$16  (via drill 0.36)
  Top 0.152: R22.2 v12.32,29.46 13.21,29.46 25.7,16.97 J1.4 | v15.11,47.37 13.25,47.37 IC5.5
  Top 0.203: J2.4 28.27,13.05 J1.4
  Bottom 0.152: v12.32,29.46 12.32,44.58 v15.11,47.37
N$17
  Top 0.152: IC5.9 7.7,58.54 R16.1
N$18  (via drill 0.36)
  Top 0.152: R21.2 v13.97,32.38 13.97,31.24 28.25,16.97 J1.5 | v15.11,43.69 IC5.2
  Bottom 0.152: J1.5 28.25,14.1 27.23,13.08 23.67,13.08 22.4,11.81 22.4,9.27 23.04,8.63 J2.5 | v15.11,43.69 13.97,42.55 v13.97,32.38
N$19
  Top 0.152: IC3.2 18.61,44.01 14.61,40.01 11.94,40.01 11.18,40.77 11.18,47.88 12.06,48.77 IC5.6
N$20
  Top 0.152: IC5.12 8.76,47.5 9.4,48.13 9.4,57.02 15.49,63.12 R18.1
N$22
  Top 0.152: IC5.4 13.25,46.35 15.49,46.35 16.13,46.99 16.13,57.02 20.7,61.59 R20.1
N$23
  Top 0.152: J3.2 27.13,75.87 23.16,75.87 15.54,68.25 15.54,65.54 R18.2
N$24
  Top 0.152: IC5.7 11.43,50.04 11.18,50.29 11.18,54.74 18.16,61.72 R19.1
N$25
  Top 0.152: R2.1 IC4.3
N$26  (via drill 0.36)
  Top 0.152: J5.7 37.77,50.37 37.77,62.74 v37.67,62.84 | v37.85,67.56 IC4.1
  Bottom 0.152: v37.67,62.84 37.67,67.39 v37.85,67.56
N$28
  Top 0.152: J5.10 49.25,52.55 49.25,60.15 IC4.5
N$30
  Top 0.152: IC3.3 19.11,43.36 15.11,39.37 10.92,39.37 9.78,40.51 9.78,45.21 8.76,46.23 IC5.13
N$31
  Top 0.152: J5.9 41.91,51.31 41.91,65.79 41.4,66.29 IC4.2
N$32
  Top 0.152: J4.3 30.73,49.53 26.34,53.92 IC2.3
N$33
  Top 0.152: IC3.7 25.47,44.01 25.91,44.45 J4.5
N$34
  Top 0.152: IC3.6 25.47,43.36 26.92,41.91 J4.6
N$35
  Top 0.152: J7.6 46.23,23.75 J5.1
N$36
  Top 0.152: LED3.2 42.42,6.97 R15.2
N$37
  Top 0.152: J7.4 42.93,25.53 42.93,27.3 44.83,29.21 J5.2
N$38
  Top 0.152: J7.3 41.27,26.42 41.27,28.45 44.58,31.75 J5.3
N$39
  Top 0.152: J7.2 39.12,26.8 39.12,28.83 44.58,34.29 J5.4
RX
  Top 0.152: J4.4 28.57,49.4 28.57,50.42 25.73,53.27 IC2.2
SEL  (via drill 0.36)
  Top 0.152: v17.09,53.26 v17.1,53.27 IC2.7 | J1.6 30.79,16.76 17.09,30.45 v17.09,32
  Top 0.203: J2.6 30.38,15.21 J1.6
  Bottom 0.152: J3.6 17.1,68.04 v17.1,53.27 v17.09,53.26 v17.09,32

### Text on the board
tNames: +3.3V | TMS | TCK | TDI | GND | TDO
tValues: Mem128, rev. A | (C)2020 David Shadoff | +5V | D0 | D1 | D2 | D3 | SEL | CLR | GND